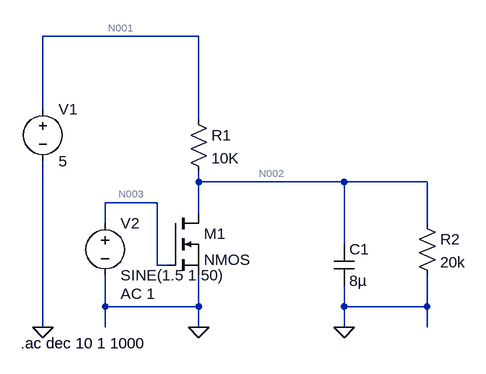
[diagram p0: schematic Q1.asc]
Q1.asc, the LTspice schematic file:
Version 4
SHEET 1 1188 680
WIRE 272 -304 32 -304
WIRE 32 -192 32 -304
WIRE 272 -176 272 -304
WIRE 272 -80 272 -96
WIRE 496 -80 272 -80
WIRE 624 -80 496 -80
WIRE 208 -48 128 -48
WIRE 272 -32 272 -80
WIRE 128 -16 128 -48
WIRE 624 -16 624 -80
WIRE 496 16 496 -80
WIRE 208 48 208 -48
WIRE 224 48 208 48
WIRE 128 112 128 64
WIRE 272 112 272 64
WIRE 272 112 128 112
WIRE 496 112 496 80
WIRE 624 112 624 64
WIRE 624 112 496 112
WIRE 32 144 32 -112
WIRE 128 144 128 112
WIRE 272 144 272 112
WIRE 496 144 496 112
WIRE 624 144 624 112
FLAG 272 144 0
FLAG 32 144 0
FLAG 496 144 0
SYMBOL nmos 224 -32 R0
SYMATTR InstName M1
SYMBOL res 256 -192 R0
SYMATTR InstName R1
SYMATTR Value 10K
SYMBOL cap 480 16 R0
SYMATTR InstName C1
SYMATTR Value 8µ
SYMBOL voltage 32 -208 R0
WINDOW 123 0 0 Left 0
WINDOW 39 0 0 Left 0
SYMATTR InstName V1
SYMATTR Value 5
SYMBOL voltage 128 -32 R0
WINDOW 123 24 124 Left 2
WINDOW 39 0 0 Left 0
SYMATTR InstName V2
SYMATTR Value SINE(1.5 1 50)
SYMATTR Value2 AC 1
SYMBOL res 608 -32 R0
SYMATTR InstName R2
SYMATTR Value 20k
TEXT -2 168 Left 2 !.ac dec 10 1 1000

The netlist it stands for:
* Q1.asc
M1 N002 N003 0 0 NMOS
R1 N001 N002 10K
C1 N002 0 8µ
V1 N001 0 5
V2 N003 0 SINE(1.5 1 50) AC 1
R2 N002 0 20k
.model NMOS NMOS
.model PMOS PMOS
.lib standard.mos
.ac dec 10 1 1000
.backanno
.end

* Results of the author's LTspice run, read from the files saved beside the schematic
* Operating Point, zero values left out:
*   V(n002) = 3.183 V
*   V(n003) = 1.5 V
*   V(n001) = 5 V
*   Id(M1) = 22.5 µA
*   Ib(M1) = -3.193 pA
*   Is(M1) = -22.5 µA
*   I(R2) = 159.2 µA
*   I(R1) = 181.7 µA
*   I(V1) = -181.7 µA
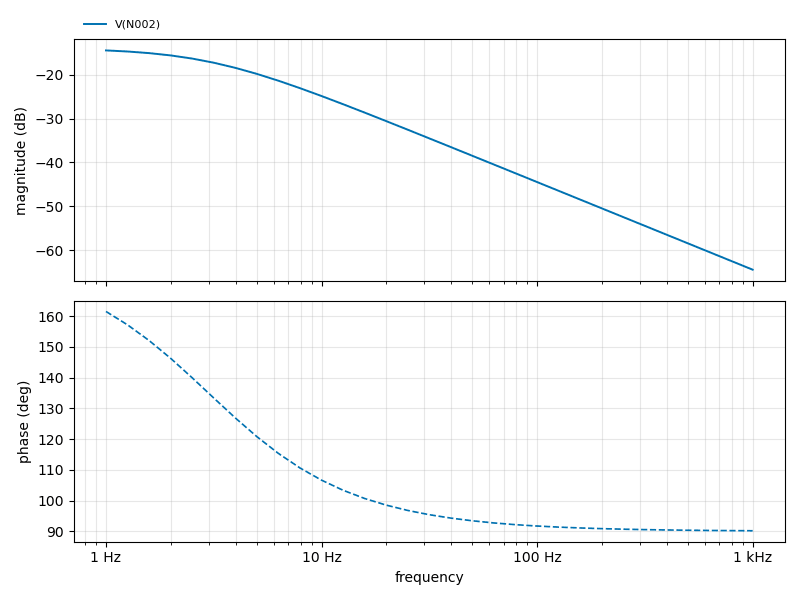
[diagram p1: AC Analysis of Q1.asc, plotted from the saved traces]
* AC Analysis, 1 run:
*   V(N002): -14.44 dB at 1 Hz, -64.48 dB at 1 kHz, peak -14.44 dB at 1 Hz, 3 dB below the peak at 3.291 Hz